# Altium project Skayboard.PrjPcb
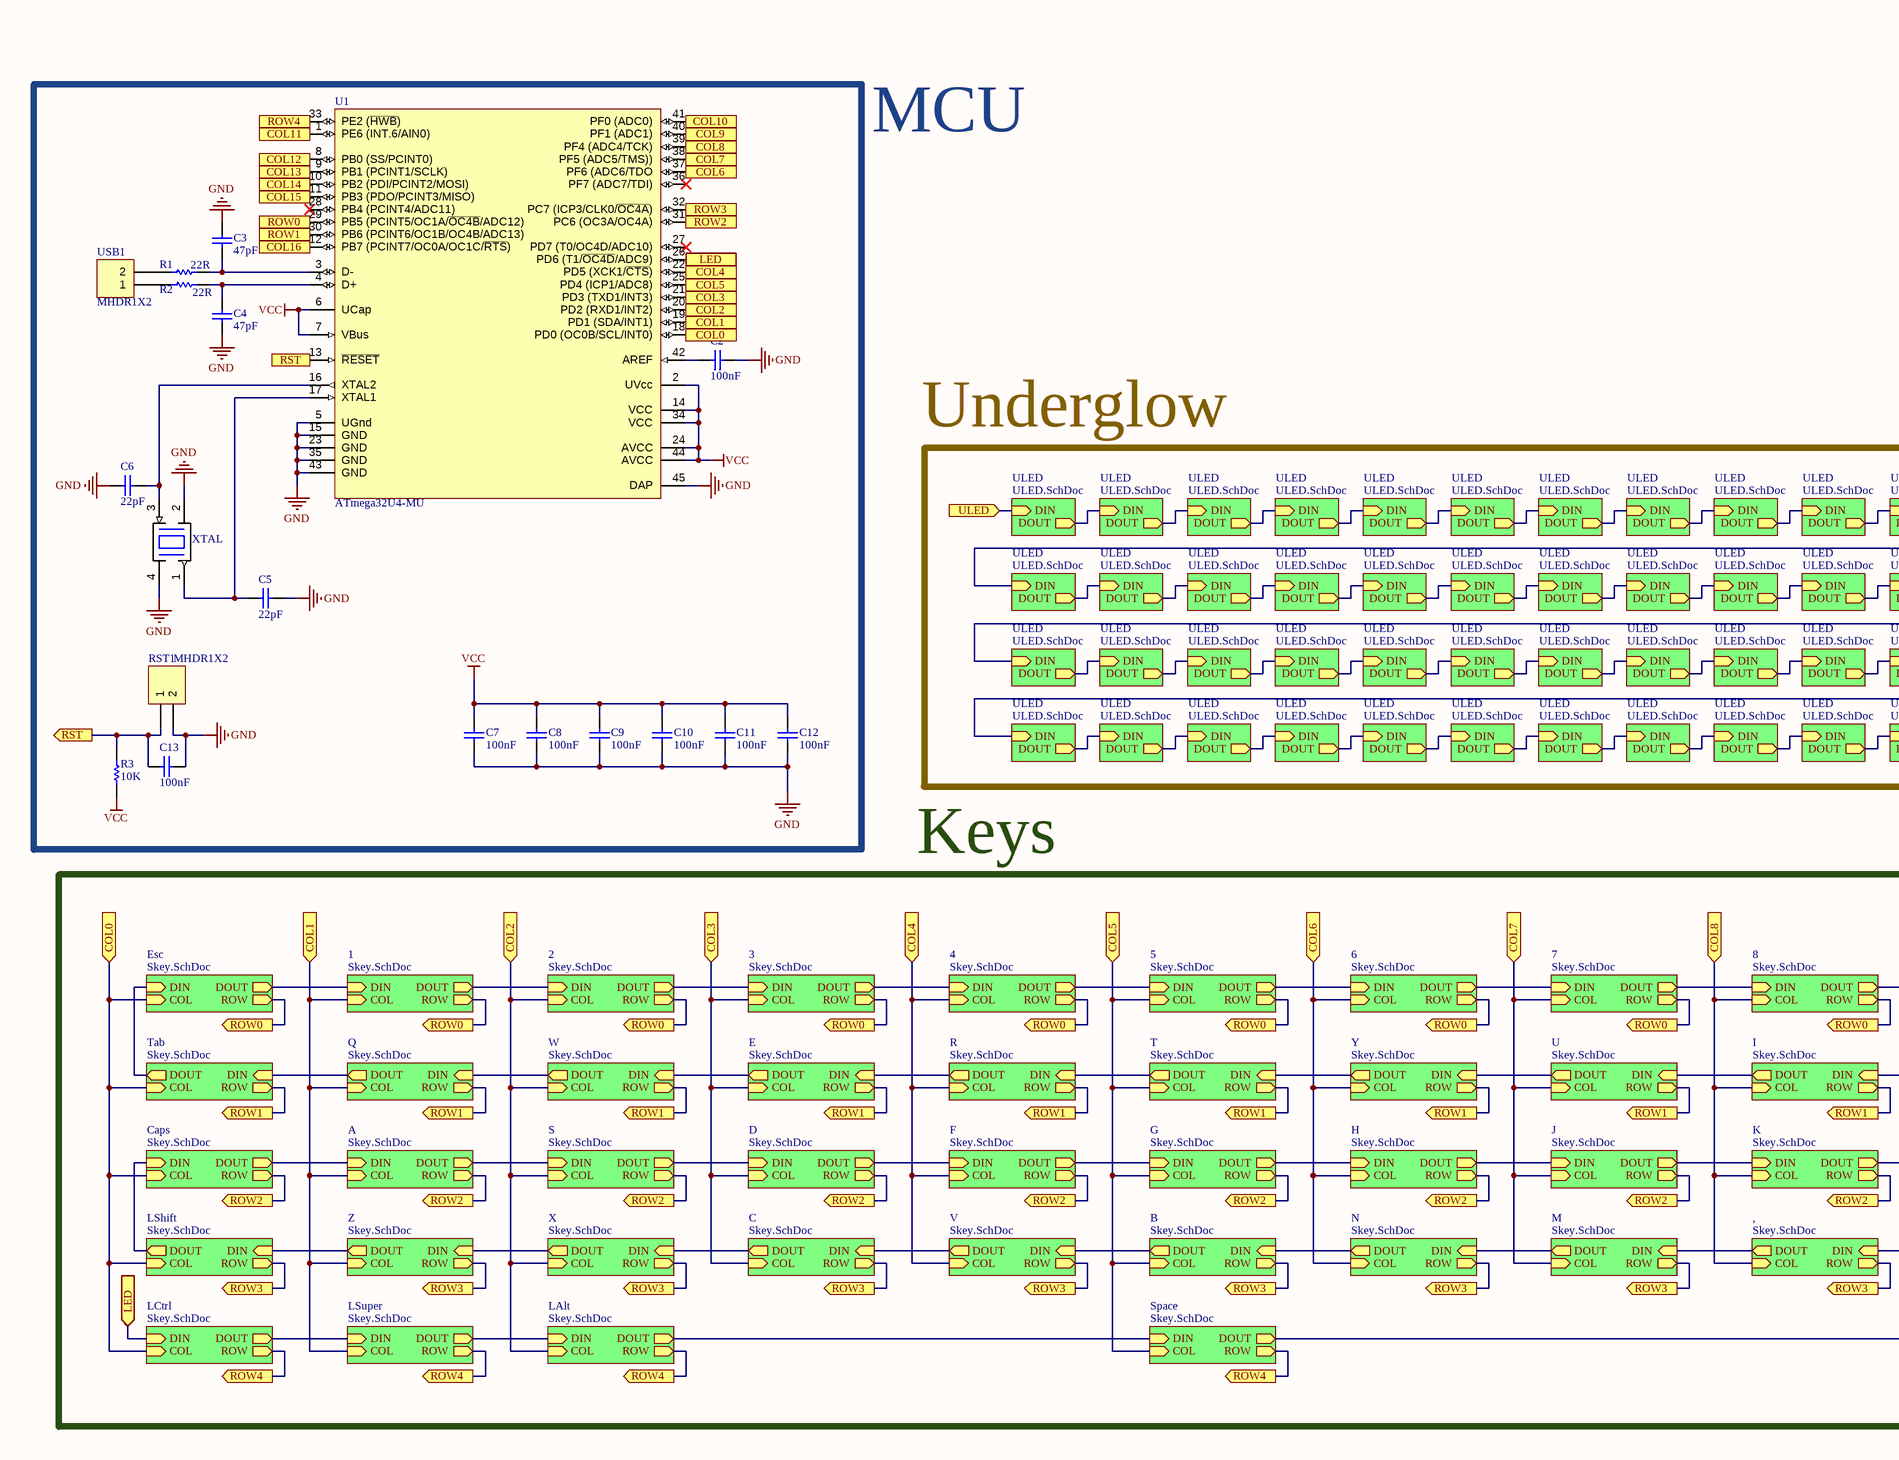
[diagram p0: Skayboard.SchDoc, left]
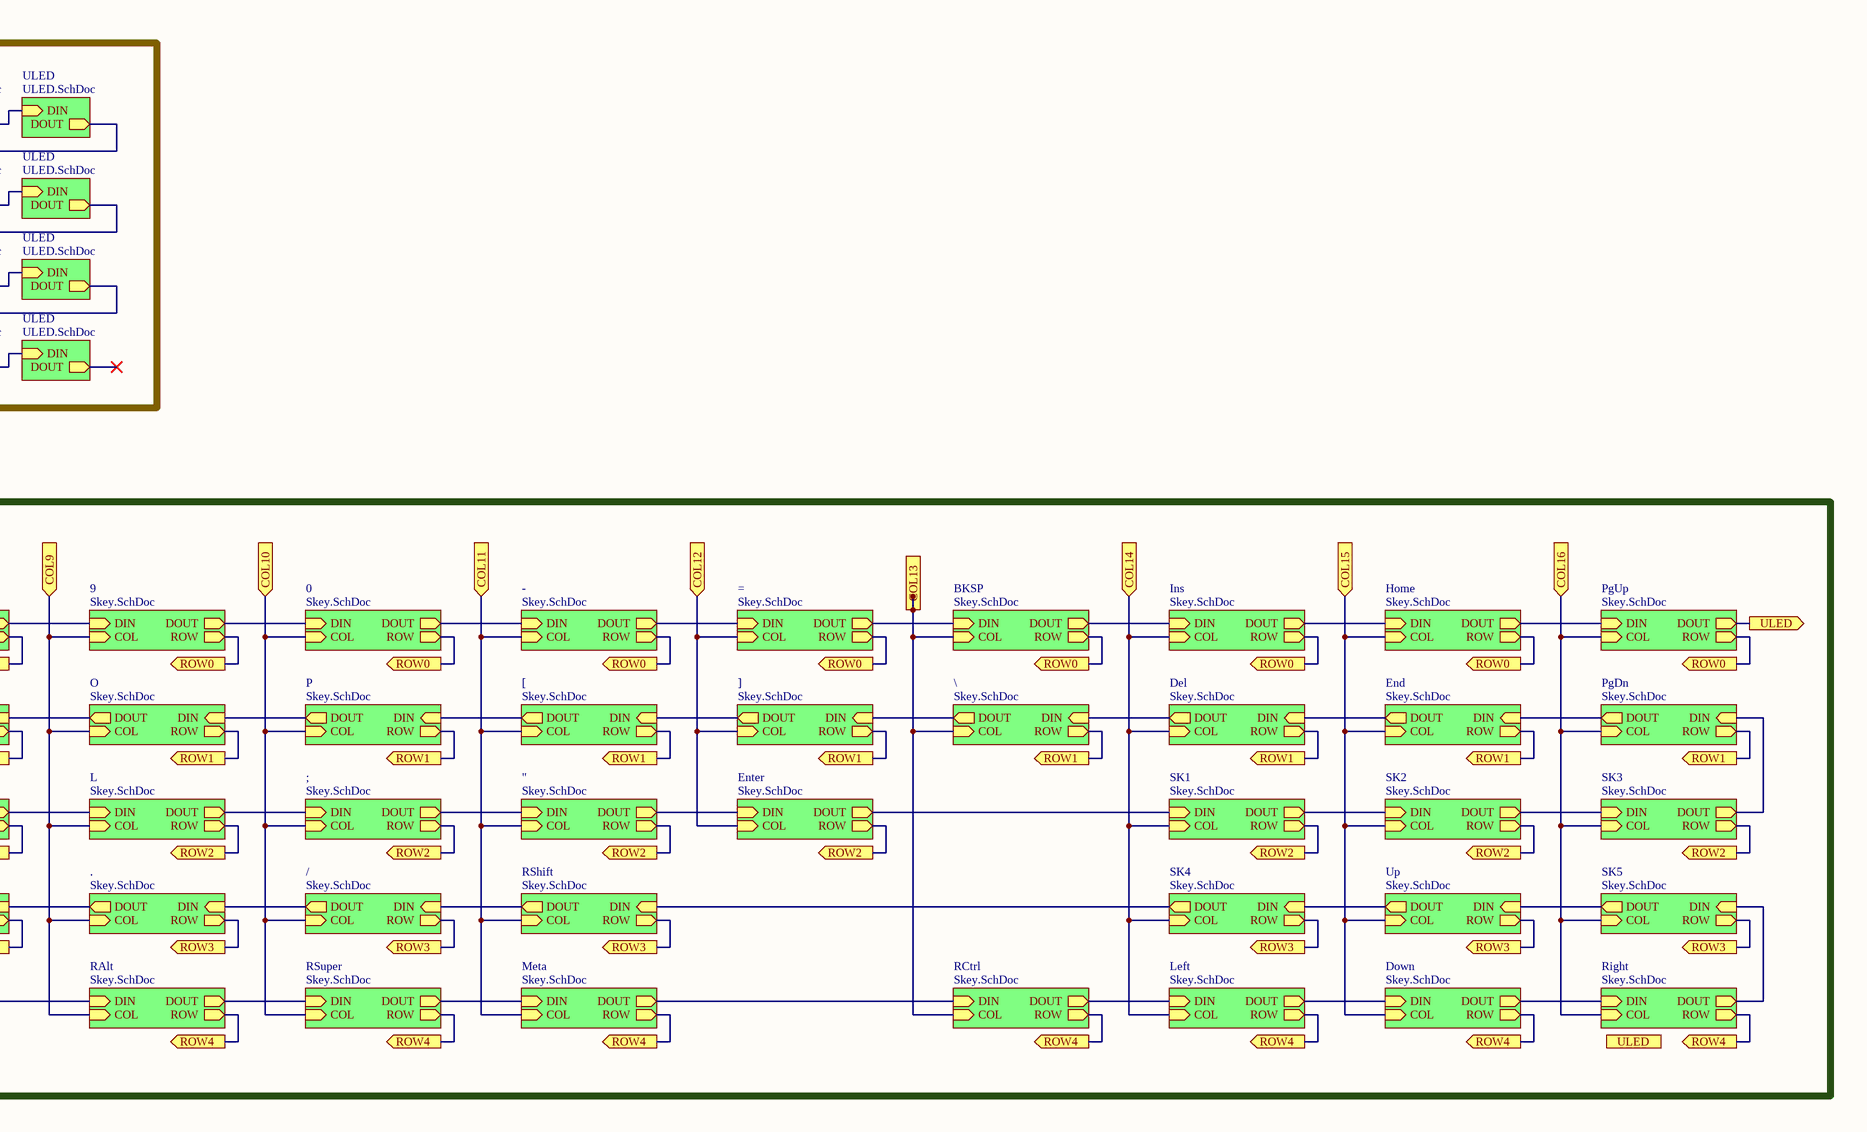
[diagram p1: Skayboard.SchDoc, right]
3 sheets, 411 parts. Net scope: hierarchical (ports join the sheet entries above them; power ports are global).
Board file: Skayboard.PcbDoc
Sheets:
  Skayboard.SchDoc
    ULED = ULED.SchDoc
    ULED = ULED.SchDoc
    ULED = ULED.SchDoc
    ULED = ULED.SchDoc
    ULED = ULED.SchDoc
    ULED = ULED.SchDoc
    ULED = ULED.SchDoc
    ULED = ULED.SchDoc
    ULED = ULED.SchDoc
    ULED = ULED.SchDoc
    ULED = ULED.SchDoc
    ULED = ULED.SchDoc
    ULED = ULED.SchDoc
    ULED = ULED.SchDoc
    ULED = ULED.SchDoc
    ULED = ULED.SchDoc
    ULED = ULED.SchDoc
    ULED = ULED.SchDoc
    ULED = ULED.SchDoc
    ULED = ULED.SchDoc
    ULED = ULED.SchDoc
    ULED = ULED.SchDoc
    ULED = ULED.SchDoc
    ULED = ULED.SchDoc
    ULED = ULED.SchDoc
    ULED = ULED.SchDoc
    ULED = ULED.SchDoc
    ULED = ULED.SchDoc
    ULED = ULED.SchDoc
    ULED = ULED.SchDoc
    ULED = ULED.SchDoc
    ULED = ULED.SchDoc
    ULED = ULED.SchDoc
    ULED = ULED.SchDoc
    ULED = ULED.SchDoc
    ULED = ULED.SchDoc
    ULED = ULED.SchDoc
    ULED = ULED.SchDoc
    ULED = ULED.SchDoc
    ULED = ULED.SchDoc
    ULED = ULED.SchDoc
    ULED = ULED.SchDoc
    ULED = ULED.SchDoc
    ULED = ULED.SchDoc
    Esc = Skey.SchDoc
    1 = Skey.SchDoc
    2 = Skey.SchDoc
    3 = Skey.SchDoc
    4 = Skey.SchDoc
    5 = Skey.SchDoc
    6 = Skey.SchDoc
    7 = Skey.SchDoc
    8 = Skey.SchDoc
    9 = Skey.SchDoc
    0 = Skey.SchDoc
    - = Skey.SchDoc
    = = Skey.SchDoc
    BKSP = Skey.SchDoc
    Ins = Skey.SchDoc
    Home = Skey.SchDoc
    PgUp = Skey.SchDoc
    Q = Skey.SchDoc
    W = Skey.SchDoc
    E = Skey.SchDoc
    R = Skey.SchDoc
    T = Skey.SchDoc
    Y = Skey.SchDoc
    U = Skey.SchDoc
    I = Skey.SchDoc
    O = Skey.SchDoc
    P = Skey.SchDoc
    [ = Skey.SchDoc
    ] = Skey.SchDoc
    \ = Skey.SchDoc
    Del = Skey.SchDoc
    End = Skey.SchDoc
    PgDn = Skey.SchDoc
    A = Skey.SchDoc
    S = Skey.SchDoc
    D = Skey.SchDoc
    F = Skey.SchDoc
    G = Skey.SchDoc
    H = Skey.SchDoc
    J = Skey.SchDoc
    K = Skey.SchDoc
    L = Skey.SchDoc
    ; = Skey.SchDoc
    " = Skey.SchDoc
    Enter = Skey.SchDoc
    RCtrl = Skey.SchDoc
    SK1 = Skey.SchDoc
    SK2 = Skey.SchDoc
    SK3 = Skey.SchDoc
    Z = Skey.SchDoc
    X = Skey.SchDoc
    C = Skey.SchDoc
    V = Skey.SchDoc
    B = Skey.SchDoc
    N = Skey.SchDoc
    M = Skey.SchDoc
    , = Skey.SchDoc
    . = Skey.SchDoc
    / = Skey.SchDoc
    RShift = Skey.SchDoc
    SK4 = Skey.SchDoc
    Up = Skey.SchDoc
    SK5 = Skey.SchDoc
    LSuper = Skey.SchDoc
    LAlt = Skey.SchDoc
    Space = Skey.SchDoc
    RAlt = Skey.SchDoc
    RSuper = Skey.SchDoc
    Meta = Skey.SchDoc
    Left = Skey.SchDoc
    Down = Skey.SchDoc
    Right = Skey.SchDoc
    Tab = Skey.SchDoc
    Caps = Skey.SchDoc
    LShift = Skey.SchDoc
    LCtrl = Skey.SchDoc

## Sheet Skayboard.SchDoc: Skayboard
size 762 x 304 mm; ApprovedBy: NNNI; CheckedBy: NNNI; Author: Skaytacium; CompanyName: Skaytacium Inc.; DrawnBy: Skaytacium; Engineer: SSSI; Organization: Skaytacium Inc.; Revision: 6

### Parts
C2  100nF  [CAPC1005X55X30LL05T10]
C3  47pF  [CAPC1005X55X25LL05T10]
C4  47pF  [CAPC1005X55X25LL05T10]
C5  22pF  [CAPC1005X56X25NL10T15]
C6  22pF  [CAPC1005X56X25NL10T15]
C7  100nF  [CAPC1005X55X30LL05T10]
C8  100nF  [CAPC1005X55X30LL05T10]
C9  100nF  [CAPC1005X55X30LL05T10]
C10  100nF  [CAPC1005X55X30LL05T10]
C11  100nF  [CAPC1005X55X30LL05T10]
C12  100nF  [CAPC1005X55X30LL05T10]
C13  100nF  [CAPC1005X55X30LL05T10]
R1  22R  [RESC1005X40X25LL05T05]
R2  22R  [RESC1005X40X25LL05T05]
R3  10K  [RESC1005X40X25NL05T05]
RST1  MHDR1X2  [MHDR1X2]
U1  ATmega32U4-MU  [44PW_M]
USB1  MHDR1X2  [MHDR1X2]
XTAL  16MCR  [XTAL16M]  (value not drawn)

### Sub-sheets
0 = Skey.SchDoc: ROW (out), COL (in), DIN (in), DOUT (out)
1 = Skey.SchDoc: ROW (out), COL (in), DIN (in), DOUT (out)
2 = Skey.SchDoc: ROW (out), COL (in), DIN (in), DOUT (out)
3 = Skey.SchDoc: ROW (out), COL (in), DIN (in), DOUT (out)
4 = Skey.SchDoc: ROW (out), COL (in), DIN (in), DOUT (out)
5 = Skey.SchDoc: ROW (out), COL (in), DIN (in), DOUT (out)
6 = Skey.SchDoc: ROW (out), COL (in), DIN (in), DOUT (out)
7 = Skey.SchDoc: ROW (out), COL (in), DIN (in), DOUT (out)
8 = Skey.SchDoc: ROW (out), COL (in), DIN (in), DOUT (out)
9 = Skey.SchDoc: ROW (out), COL (in), DIN (in), DOUT (out)
" = Skey.SchDoc: ROW (out), COL (in), DIN (in), DOUT (out)
, = Skey.SchDoc: ROW (out), COL (in), DIN (in), DOUT (out)
- = Skey.SchDoc: ROW (out), COL (in), DIN (in), DOUT (out)
. = Skey.SchDoc: ROW (out), COL (in), DIN (in), DOUT (out)
/ = Skey.SchDoc: ROW (out), COL (in), DIN (in), DOUT (out)
; = Skey.SchDoc: ROW (out), COL (in), DIN (in), DOUT (out)
= = Skey.SchDoc: ROW (out), COL (in), DIN (in), DOUT (out)
[ = Skey.SchDoc: ROW (out), COL (in), DIN (in), DOUT (out)
\ = Skey.SchDoc: ROW (out), COL (in), DIN (in), DOUT (out)
] = Skey.SchDoc: ROW (out), COL (in), DIN (in), DOUT (out)
A = Skey.SchDoc: ROW (out), COL (in), DIN (in), DOUT (out)
B = Skey.SchDoc: ROW (out), COL (in), DIN (in), DOUT (out)
BKSP = Skey.SchDoc: ROW (out), COL (in), DIN (in), DOUT (out)
C = Skey.SchDoc: ROW (out), COL (in), DIN (in), DOUT (out)
Caps = Skey.SchDoc: ROW (out), COL (in), DIN (in), DOUT (out)
D = Skey.SchDoc: ROW (out), COL (in), DIN (in), DOUT (out)
Del = Skey.SchDoc: ROW (out), COL (in), DIN (in), DOUT (out)
Down = Skey.SchDoc: ROW (out), COL (in), DIN (in), DOUT (out)
E = Skey.SchDoc: ROW (out), COL (in), DIN (in), DOUT (out)
End = Skey.SchDoc: ROW (out), COL (in), DIN (in), DOUT (out)
Enter = Skey.SchDoc: ROW (out), COL (in), DIN (in), DOUT (out)
Esc = Skey.SchDoc: ROW (out), COL (in), DIN (in), DOUT (out)
F = Skey.SchDoc: ROW (out), COL (in), DIN (in), DOUT (out)
G = Skey.SchDoc: ROW (out), COL (in), DIN (in), DOUT (out)
H = Skey.SchDoc: ROW (out), COL (in), DIN (in), DOUT (out)
Home = Skey.SchDoc: ROW (out), COL (in), DIN (in), DOUT (out)
I = Skey.SchDoc: ROW (out), COL (in), DIN (in), DOUT (out)
Ins = Skey.SchDoc: ROW (out), COL (in), DIN (in), DOUT (out)
J = Skey.SchDoc: ROW (out), COL (in), DIN (in), DOUT (out)
K = Skey.SchDoc: ROW (out), COL (in), DIN (in), DOUT (out)
L = Skey.SchDoc: ROW (out), COL (in), DIN (in), DOUT (out)
LAlt = Skey.SchDoc: ROW (out), COL (in), DIN (in), DOUT (out)
LCtrl = Skey.SchDoc: ROW (out), COL (in), DIN (in), DOUT (out)
Left = Skey.SchDoc: ROW (out), COL (in), DIN (in), DOUT (out)
LShift = Skey.SchDoc: ROW (out), COL (in), DIN (in), DOUT (out)
LSuper = Skey.SchDoc: ROW (out), COL (in), DIN (in), DOUT (out)
M = Skey.SchDoc: ROW (out), COL (in), DIN (in), DOUT (out)
Meta = Skey.SchDoc: ROW (out), COL (in), DIN (in), DOUT (out)
N = Skey.SchDoc: ROW (out), COL (in), DIN (in), DOUT (out)
O = Skey.SchDoc: ROW (out), COL (in), DIN (in), DOUT (out)
P = Skey.SchDoc: ROW (out), COL (in), DIN (in), DOUT (out)
PgDn = Skey.SchDoc: ROW (out), COL (in), DIN (in), DOUT (out)
PgUp = Skey.SchDoc: ROW (out), COL (in), DIN (in), DOUT (out)
Q = Skey.SchDoc: ROW (out), COL (in), DIN (in), DOUT (out)
R = Skey.SchDoc: ROW (out), COL (in), DIN (in), DOUT (out)
RAlt = Skey.SchDoc: ROW (out), COL (in), DIN (in), DOUT (out)
RCtrl = Skey.SchDoc: ROW (out), COL (in), DIN (in), DOUT (out)
Right = Skey.SchDoc: ROW (out), COL (in), DIN (in), DOUT (out)
RShift = Skey.SchDoc: ROW (out), COL (in), DIN (in), DOUT (out)
RSuper = Skey.SchDoc: ROW (out), COL (in), DIN (in), DOUT (out)
S = Skey.SchDoc: ROW (out), COL (in), DIN (in), DOUT (out)
SK1 = Skey.SchDoc: ROW (out), COL (in), DIN (in), DOUT (out)
SK2 = Skey.SchDoc: ROW (out), COL (in), DIN (in), DOUT (out)
SK3 = Skey.SchDoc: ROW (out), COL (in), DIN (in), DOUT (out)
SK4 = Skey.SchDoc: ROW (out), COL (in), DIN (in), DOUT (out)
SK5 = Skey.SchDoc: ROW (out), COL (in), DIN (in), DOUT (out)
Space = Skey.SchDoc: ROW (out), COL (in), DIN (in), DOUT (out)
T = Skey.SchDoc: ROW (out), COL (in), DIN (in), DOUT (out)
Tab = Skey.SchDoc: ROW (out), COL (in), DIN (in), DOUT (out)
U = Skey.SchDoc: ROW (out), COL (in), DIN (in), DOUT (out)
ULED = ULED.SchDoc: DOUT (out), DIN (in)
ULED = ULED.SchDoc: DOUT (out), DIN (in)
ULED = ULED.SchDoc: DOUT (out), DIN (in)
ULED = ULED.SchDoc: DOUT (out), DIN (in)
ULED = ULED.SchDoc: DOUT (out), DIN (in)
ULED = ULED.SchDoc: DOUT (out), DIN (in)
ULED = ULED.SchDoc: DOUT (out), DIN (in)
ULED = ULED.SchDoc: DOUT (out), DIN (in)
ULED = ULED.SchDoc: DOUT (out), DIN (in)
ULED = ULED.SchDoc: DOUT (out), DIN (in)
ULED = ULED.SchDoc: DOUT (out), DIN (in)
ULED = ULED.SchDoc: DOUT (out), DIN (in)
ULED = ULED.SchDoc: DOUT (out), DIN (in)
ULED = ULED.SchDoc: DOUT (out), DIN (in)
ULED = ULED.SchDoc: DOUT (out), DIN (in)
ULED = ULED.SchDoc: DOUT (out), DIN (in)
ULED = ULED.SchDoc: DOUT (out), DIN (in)
ULED = ULED.SchDoc: DOUT (out), DIN (in)
ULED = ULED.SchDoc: DOUT (out), DIN (in)
ULED = ULED.SchDoc: DOUT (out), DIN (in)
ULED = ULED.SchDoc: DOUT (out), DIN (in)
ULED = ULED.SchDoc: DOUT (out), DIN (in)
ULED = ULED.SchDoc: DOUT (out), DIN (in)
ULED = ULED.SchDoc: DOUT (out), DIN (in)
ULED = ULED.SchDoc: DOUT (out), DIN (in)
ULED = ULED.SchDoc: DOUT (out), DIN (in)
ULED = ULED.SchDoc: DOUT (out), DIN (in)
ULED = ULED.SchDoc: DOUT (out), DIN (in)
ULED = ULED.SchDoc: DOUT (out), DIN (in)
ULED = ULED.SchDoc: DOUT (out), DIN (in)
ULED = ULED.SchDoc: DOUT (out), DIN (in)
ULED = ULED.SchDoc: DOUT (out), DIN (in)
ULED = ULED.SchDoc: DOUT (out), DIN (in)
ULED = ULED.SchDoc: DOUT (out), DIN (in)
ULED = ULED.SchDoc: DOUT (out), DIN (in)
ULED = ULED.SchDoc: DOUT (out), DIN (in)
ULED = ULED.SchDoc: DOUT (out), DIN (in)
ULED = ULED.SchDoc: DOUT (out), DIN (in)
ULED = ULED.SchDoc: DOUT (out), DIN (in)
ULED = ULED.SchDoc: DOUT (out), DIN (in)
ULED = ULED.SchDoc: DOUT (out), DIN (in)
ULED = ULED.SchDoc: DOUT (out), DIN (in)
ULED = ULED.SchDoc: DOUT (out), DIN (in)
ULED = ULED.SchDoc: DOUT (out), DIN (in)
Up = Skey.SchDoc: ROW (out), COL (in), DIN (in), DOUT (out)
V = Skey.SchDoc: ROW (out), COL (in), DIN (in), DOUT (out)
W = Skey.SchDoc: ROW (out), COL (in), DIN (in), DOUT (out)
X = Skey.SchDoc: ROW (out), COL (in), DIN (in), DOUT (out)
Y = Skey.SchDoc: ROW (out), COL (in), DIN (in), DOUT (out)
Z = Skey.SchDoc: ROW (out), COL (in), DIN (in), DOUT (out)

### Ports
COL0 (in), COL0 (out), COL1 (in), COL1 (out), COL2 (in), COL2 (out), COL3 (in), COL3 (out), COL4 (in), COL4 (out), COL5 (in), COL5 (out), COL6 (in), COL6 (out), COL7 (in), COL7 (out), COL8 (in), COL8 (out), COL9 (in), COL9 (out), COL10 (in), COL10 (out), COL11 (in), COL11 (out), COL12 (in), COL12 (out), COL13 (in), COL13 (out), COL14 (in), COL14 (out), COL15 (in), COL15 (out), COL16 (in), COL16 (out), LED (in), LED (out), ROW0 (in), ROW0 (out), ROW1 (in), ROW1 (out), ROW2 (in), ROW2 (out), ROW3 (in), ROW3 (out), ROW4 (in), ROW4 (out), RST (in), RST (out), ULED (in), ULED (out)

### Nets
GND: C2.2 C3.2 C4.1 C5.1 C6.1 C7.1 C8.1 C9.1 C10.1 C11.1 C12.1 C13.1 RST1.2 U1.5(UGnd) U1.15(GND) U1.23(GND) U1.35(GND) U1.43(GND) U1.45(DAP) XTAL.2 XTAL.4
VCC: C7.2 C8.2 C9.2 C10.2 C11.2 C12.2 R3.1 U1.2(UVcc) U1.6(UCap) U1.7(VBus) U1.14(VCC) U1.24(AVCC) U1.34(VCC) U1.44(AVCC)
NetC2_1: C2.1 U1.42(AREF)
NetC3_1: C3.1 R1.1 U1.3(D-)
NetC4_2: C4.2 R2.1 U1.4(D+)
NetC5_2: C5.2 U1.17(XTAL1) XTAL.1
NetC6_2: C6.2 U1.16(XTAL2) XTAL.3
NetC13_2: C13.2 R3.2 RST1.1 U1.13(~{RESET}) ; port RST
NetD_0_2: U1.29(PB5_(PCINT5/OC1A/~{OC4B}/ADC12)) ; port ROW0, sheet Esc/ROW, sheet 1/ROW, sheet 2/ROW, sheet 3/ROW, sheet 4/ROW, sheet 5/ROW, sheet 6/ROW, sheet 7/ROW, sheet 8/ROW, sheet 9/ROW, sheet 0/ROW, sheet -/ROW, sheet =/ROW, sheet BKSP/ROW, sheet Ins/ROW, sheet Home/ROW, sheet PgUp/ROW
NetD_"_2: U1.31(PC6_(OC3A/OC4A)) ; port ROW2, sheet A/ROW, sheet S/ROW, sheet D/ROW, sheet F/ROW, sheet G/ROW, sheet H/ROW, sheet J/ROW, sheet K/ROW, sheet L/ROW, sheet ;/ROW, sheet "/ROW, sheet Enter/ROW, sheet SK1/ROW, sheet SK2/ROW, sheet SK3/ROW, sheet Caps/ROW
NetD_,_2: U1.32(PC7_(ICP3/CLK0/~{OC4A})) ; port ROW3, sheet Z/ROW, sheet X/ROW, sheet C/ROW, sheet V/ROW, sheet B/ROW, sheet N/ROW, sheet M/ROW, sheet ,/ROW, sheet ./ROW, sheet //ROW, sheet RShift/ROW, sheet SK4/ROW, sheet Up/ROW, sheet SK5/ROW, sheet LShift/ROW
NetD_[_2: U1.30(PB6_(PCINT6/OC1B/OC4B/ADC13)) ; port ROW1, sheet Q/ROW, sheet W/ROW, sheet E/ROW, sheet R/ROW, sheet T/ROW, sheet Y/ROW, sheet U/ROW, sheet I/ROW, sheet O/ROW, sheet P/ROW, sheet [/ROW, sheet ]/ROW, sheet \/ROW, sheet Del/ROW, sheet End/ROW, sheet PgDn/ROW, sheet Tab/ROW
NetD_Down_2: U1.33(PE2_(~{HWB})) ; port ROW4, sheet RCtrl/ROW, sheet LSuper/ROW, sheet LAlt/ROW, sheet Space/ROW, sheet RAlt/ROW, sheet RSuper/ROW, sheet Meta/ROW, sheet Left/ROW, sheet Down/ROW, sheet Right/ROW, sheet LCtrl/ROW
NetLED_0_2: sheet 0/DOUT, sheet -/DIN
NetLED_0_4: sheet 9/DOUT, sheet 0/DIN
NetLED_1_2: sheet 1/DOUT, sheet 2/DIN
NetLED_1_4: sheet Esc/DOUT, sheet 1/DIN
NetLED_2_2: sheet 2/DOUT, sheet 3/DIN
NetLED_3_2: sheet 3/DOUT, sheet 4/DIN
NetLED_4_2: sheet 4/DOUT, sheet 5/DIN
NetLED_5_2: sheet 5/DOUT, sheet 6/DIN
NetLED_6_2: sheet 6/DOUT, sheet 7/DIN
NetLED_7_2: sheet 7/DOUT, sheet 8/DIN
NetLED_8_2: sheet 8/DOUT, sheet 9/DIN
NetLED_"_2: sheet "/DOUT, sheet Enter/DIN
NetLED_"_4: sheet ;/DOUT, sheet "/DIN
NetLED_,_2: sheet M/DIN, sheet ,/DOUT
NetLED_,_4: sheet ,/DIN, sheet ./DOUT
NetLED_-_2: sheet -/DOUT, sheet =/DIN
NetLED_._4: sheet ./DIN, sheet //DOUT
NetLED_/_4: sheet //DIN, sheet RShift/DOUT
NetLED_;_4: sheet L/DOUT, sheet ;/DIN
NetLED_=_2: sheet =/DOUT, sheet BKSP/DIN
NetLED_[_2: sheet P/DIN, sheet [/DOUT
NetLED_[_4: sheet [/DIN, sheet ]/DOUT
NetLED~{_}_2: sheet ]/DIN, sheet \/DOUT
NetLED~{_}_4: sheet \/DIN, sheet Del/DOUT
NetLED_A_2: sheet A/DOUT, sheet S/DIN
NetLED_A_4: sheet A/DIN, sheet Caps/DOUT
NetLED_B_2: sheet V/DIN, sheet B/DOUT
NetLED_B_4: sheet B/DIN, sheet N/DOUT
NetLED_BKSP_2: sheet BKSP/DOUT, sheet Ins/DIN
NetLED_C_2: sheet X/DIN, sheet C/DOUT
NetLED_C_4: sheet C/DIN, sheet V/DOUT
NetLED_Caps_4: sheet Caps/DIN, sheet LShift/DOUT
NetLED_D_2: sheet D/DOUT, sheet F/DIN
NetLED_D_4: sheet S/DOUT, sheet D/DIN
NetLED_Del_4: sheet Del/DIN, sheet End/DOUT
NetLED_Down_2: sheet Down/DOUT, sheet Right/DIN
NetLED_Down_4: sheet Left/DOUT, sheet Down/DIN
NetLED_E_2: sheet W/DIN, sheet E/DOUT
NetLED_E_4: sheet E/DIN, sheet R/DOUT
NetLED_End_4: sheet End/DIN, sheet PgDn/DOUT
NetLED_Enter_2: sheet Enter/DOUT, sheet SK1/DIN
NetLED_Esc_4: sheet Esc/DIN, sheet Tab/DOUT
NetLED_F_2: sheet F/DOUT, sheet G/DIN
NetLED_G_2: sheet G/DOUT, sheet H/DIN
NetLED_H_2: sheet H/DOUT, sheet J/DIN
NetLED_Home_2: sheet Home/DOUT, sheet PgUp/DIN
NetLED_Home_4: sheet Ins/DOUT, sheet Home/DIN
NetLED_I_2: sheet U/DIN, sheet I/DOUT
NetLED_I_4: sheet I/DIN, sheet O/DOUT
NetLED_J_2: sheet J/DOUT, sheet K/DIN
NetLED_K_2: sheet K/DOUT, sheet L/DIN
NetLED_LAlt_2: sheet LAlt/DOUT, sheet Space/DIN
NetLED_LAlt_4: sheet LSuper/DOUT, sheet LAlt/DIN
NetLED_LCtrl_2: sheet LSuper/DIN, sheet LCtrl/DOUT
NetLED_LCtrl_4: U1.26(PD6_(T1/~{OC4D}/ADC9)) ; port LED, sheet LCtrl/DIN
NetLED_Left_4: sheet RCtrl/DOUT, sheet Left/DIN
NetLED_LShift_4: sheet Z/DOUT, sheet LShift/DIN
NetLED_M_2: sheet N/DIN, sheet M/DOUT
NetLED_Meta_2: sheet RCtrl/DIN, sheet Meta/DOUT
NetLED_Meta_4: sheet RSuper/DOUT, sheet Meta/DIN
NetLED_O_4: sheet O/DIN, sheet P/DOUT
NetLED_PgDn_4: sheet PgDn/DIN, sheet SK3/DOUT
NetLED_PgUp_2: port ULED, sheet ULED/DIN, sheet PgUp/DOUT
NetLED_Q_2: sheet Q/DOUT, sheet Tab/DIN
NetLED_Q_4: sheet Q/DIN, sheet W/DOUT
NetLED_R_4: sheet R/DIN, sheet T/DOUT
NetLED_RAlt_2: sheet RAlt/DOUT, sheet RSuper/DIN
NetLED_RAlt_4: sheet Space/DOUT, sheet RAlt/DIN
NetLED_Right_2: sheet SK5/DIN, sheet Right/DOUT
NetLED_RShift_4: sheet RShift/DIN, sheet SK4/DOUT
NetLED_SK1_2: sheet SK1/DOUT, sheet SK2/DIN
NetLED_SK2_2: sheet SK2/DOUT, sheet SK3/DIN
NetLED_SK4_4: sheet SK4/DIN, sheet Up/DOUT
NetLED_SK5_2: sheet Up/DIN, sheet SK5/DOUT
NetLED_T_4: sheet T/DIN, sheet Y/DOUT
NetLED_U_2: sheet Y/DIN, sheet U/DOUT
NetLED_X_2: sheet Z/DIN, sheet X/DOUT
NetMX_0_1: U1.41(PF0_(ADC0)) ; port COL10, sheet 0/COL, sheet P/COL, sheet ;/COL, sheet //COL, sheet RSuper/COL
NetMX_1_1: U1.19(PD1_(SDA/INT1)) ; port COL1, sheet 1/COL, sheet Q/COL, sheet A/COL, sheet Z/COL, sheet LSuper/COL
NetMX_2_1: U1.20(PD2_(RXD1/INT2)) ; port COL2, sheet 2/COL, sheet W/COL, sheet S/COL, sheet X/COL, sheet LAlt/COL
NetMX_3_1: U1.21(PD3_(TXD1/INT3)) ; port COL3, sheet 3/COL, sheet E/COL, sheet D/COL, sheet C/COL
NetMX_4_1: U1.22(PD5_(XCK1/~{CTS})) ; port COL4, sheet 4/COL, sheet R/COL, sheet F/COL, sheet V/COL
NetMX_5_1: U1.25(PD4_(ICP1/ADC8)) ; port COL5, sheet 5/COL, sheet T/COL, sheet G/COL, sheet B/COL, sheet Space/COL
NetMX_6_1: U1.37(PF6_(ADC6/TDO) ; port COL6, sheet 6/COL, sheet Y/COL, sheet H/COL, sheet N/COL
NetMX_7_1: U1.38(PF5_(ADC5/TMS))) ; port COL7, sheet 7/COL, sheet U/COL, sheet J/COL, sheet M/COL
NetMX_8_1: U1.39(PF4_(ADC4/TCK)) ; port COL8, sheet 8/COL, sheet I/COL, sheet K/COL, sheet ,/COL
NetMX_9_1: U1.40(PF1_(ADC1)) ; port COL9, sheet 9/COL, sheet O/COL, sheet L/COL, sheet ./COL, sheet RAlt/COL
NetMX_"_1: U1.1(PE6_(INT.6/AIN0)) ; port COL11, sheet -/COL, sheet [/COL, sheet "/COL, sheet RShift/COL, sheet Meta/COL
NetMX_=_1: U1.8(PB0_(SS/PCINT0)) ; port COL12, sheet =/COL, sheet ]/COL, sheet Enter/COL
NetMX~{_}_1: U1.9(PB1_(PCINT1/SCLK)) ; port COL13, sheet BKSP/COL, sheet \/COL, sheet RCtrl/COL
NetMX_Caps_1: U1.18(PD0_(OC0B/SCL/INT0)) ; port COL0, sheet Esc/COL, sheet Tab/COL, sheet Caps/COL, sheet LShift/COL, sheet LCtrl/COL
NetMX_Del_1: U1.10(PB2_(PDI/PCINT2/MOSI)) ; port COL14, sheet Ins/COL, sheet Del/COL, sheet SK1/COL, sheet SK4/COL, sheet Left/COL
NetMX_Down_1: U1.11(PB3_(PDO/PCINT3/MISO)) ; port COL15, sheet Home/COL, sheet End/COL, sheet SK2/COL, sheet Up/COL, sheet Down/COL
NetMX_PgDn_1: U1.12(PB7_(PCINT7/OC0A/OC1C/~{RTS})) ; port COL16, sheet PgUp/COL, sheet PgDn/COL, sheet SK3/COL, sheet SK5/COL, sheet Right/COL
NetR1_2: R1.2 USB1.2
NetR2_2: R2.2 USB1.1
NetSKLED#1_2: sheet ULED/DOUT, sheet ULED/DIN
NetSKLED#2_2: sheet ULED/DOUT, sheet ULED/DIN
NetSKLED#3_2: sheet ULED/DOUT, sheet ULED/DIN
NetSKLED#4_2: sheet ULED/DOUT, sheet ULED/DIN
NetSKLED#5_2: sheet ULED/DOUT, sheet ULED/DIN
NetSKLED#6_2: sheet ULED/DOUT, sheet ULED/DIN
NetSKLED#7_2: sheet ULED/DOUT, sheet ULED/DIN
NetSKLED#8_2: sheet ULED/DOUT, sheet ULED/DIN
NetSKLED#9_2: sheet ULED/DOUT, sheet ULED/DIN
NetSKLED#10_2: sheet ULED/DOUT, sheet ULED/DIN
NetSKLED#11_2: sheet ULED/DOUT, sheet ULED/DIN
NetSKLED#12_2: sheet ULED/DOUT, sheet ULED/DIN
NetSKLED#13_2: sheet ULED/DOUT, sheet ULED/DIN
NetSKLED#14_2: sheet ULED/DOUT, sheet ULED/DIN
NetSKLED#15_2: sheet ULED/DOUT, sheet ULED/DIN
NetSKLED#16_2: sheet ULED/DOUT, sheet ULED/DIN
NetSKLED#17_2: sheet ULED/DOUT, sheet ULED/DIN
NetSKLED#18_2: sheet ULED/DOUT, sheet ULED/DIN
NetSKLED#19_2: sheet ULED/DOUT, sheet ULED/DIN
NetSKLED#20_2: sheet ULED/DOUT, sheet ULED/DIN
NetSKLED#21_2: sheet ULED/DOUT, sheet ULED/DIN
NetSKLED#22_2: sheet ULED/DOUT, sheet ULED/DIN
NetSKLED#23_2: sheet ULED/DOUT, sheet ULED/DIN
NetSKLED#24_2: sheet ULED/DOUT, sheet ULED/DIN
NetSKLED#25_2: sheet ULED/DOUT, sheet ULED/DIN
NetSKLED#26_2: sheet ULED/DOUT, sheet ULED/DIN
NetSKLED#27_2: sheet ULED/DOUT, sheet ULED/DIN
NetSKLED#28_2: sheet ULED/DOUT, sheet ULED/DIN
NetSKLED#29_2: sheet ULED/DOUT, sheet ULED/DIN
NetSKLED#30_2: sheet ULED/DOUT, sheet ULED/DIN
NetSKLED#31_2: sheet ULED/DOUT, sheet ULED/DIN
NetSKLED#32_2: sheet ULED/DOUT, sheet ULED/DIN
NetSKLED#33_2: sheet ULED/DOUT, sheet ULED/DIN
NetSKLED#34_2: sheet ULED/DOUT, sheet ULED/DIN
NetSKLED#35_2: sheet ULED/DOUT, sheet ULED/DIN
NetSKLED#36_2: sheet ULED/DOUT, sheet ULED/DIN
NetSKLED#37_2: sheet ULED/DOUT, sheet ULED/DIN
NetSKLED#38_2: sheet ULED/DOUT, sheet ULED/DIN
NetSKLED#39_2: sheet ULED/DOUT, sheet ULED/DIN
NetSKLED#40_2: sheet ULED/DOUT, sheet ULED/DIN
NetSKLED#41_2: sheet ULED/DOUT, sheet ULED/DIN
NetSKLED#42_2: sheet ULED/DOUT, sheet ULED/DIN
NetSKLED#43_2: sheet ULED/DOUT, sheet ULED/DIN

Not connected (* = marked no-connect by the designer): U1 27(PD7_(T0/OC4D/ADC10))* 28(PB4_(PCINT4/ADC11))* 36(PF7_(ADC7/TDI))*

### Notes on the sheet
- MCU
- Underglow
- Keys

### Library data of the parts
C2 C7-C13 = CMP-0001-00074-2: Manufacturer: Kemet; Part Number: C0402C104K4RACTU
C3 C4 = CMP-2008-04368-1: Part Number: GRM1555C1H470JA01D; Manufacturer: Murata
C5 C6 = CMP-2008-02613-1: Part Number: 04025A220JAT2A; Manufacturer: AVX Interconnect / Elco
R1 R2 = CMP-2002-08382-1: 22; Manufacturer: Vishay Dale; Part Number: CRCW040222R0FKED
R3 = CMP-2002-01183-1: Part Number: ERT-J0ER103J; Manufacturer: Panasonic
RST1 USB1 = MHDR1X2: Header, 2-Pin
U1 = CMP-0095-00166-2: 8-bit AVR Microcontroller, 2.7-5.5V, 16MHz, 32KB Flash, 1KB EEPROM, 2.5KB SRAM, USB Controller, 44-pin QFN, Industrial Grade (-40°C to 85°C), Ext Osc
XTAL = 16MCR: 16Mhz crystal resonator, JLCPCB #C13738

## Sheet ULED.SchDoc
size 76 x 50 mm
Used 44 times, as channels ULED, ULED, ULED, ULED, ULED, ULED, ULED, ULED, ULED, ULED, ULED, ULED, ULED, ULED, ULED, ULED, ULED, ULED, ULED, ULED, ULED, ULED, ULED, ULED, ULED, ULED, ULED, ULED, ULED, ULED, ULED, ULED, ULED, ULED, ULED, ULED, ULED, ULED, ULED, ULED, ULED, ULED, ULED, ULED. Parts and nets are listed once, with the designators drawn on the sheet.
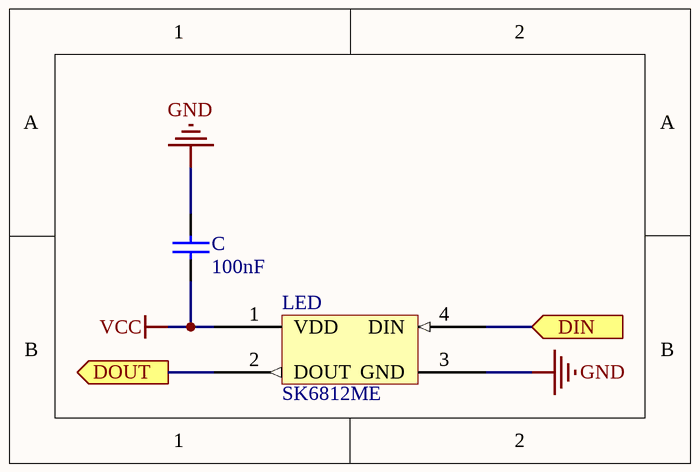
[diagram p2: ULED.SchDoc]

### Parts
C  100nF  [CAPC1005X55X30LL05T10]
LED  SK6812ME  [SK6812ME]

### Ports
DIN (in), DOUT (out)

### Nets
GND: C.2 LED.3(GND)
VCC: C.1 LED.1(VDD)
DIN: LED.4(DIN) ; port DIN
DOUT: LED.2(DOUT) ; port DOUT

### Channels
ULED: designators C=C1#1 LED=SKLED#1; ports DIN=NetLED_PgUp_2 DOUT=NetSKLED#1_2
ULED: designators C=C1#2 LED=SKLED#2; ports DIN=NetSKLED#1_2 DOUT=NetSKLED#2_2
ULED: designators C=C1#3 LED=SKLED#3; ports DIN=NetSKLED#2_2 DOUT=NetSKLED#3_2
ULED: designators C=C1#4 LED=SKLED#4; ports DIN=NetSKLED#3_2 DOUT=NetSKLED#4_2
ULED: designators C=C1#5 LED=SKLED#5; ports DIN=NetSKLED#4_2 DOUT=NetSKLED#5_2
ULED: designators C=C1#6 LED=SKLED#6; ports DIN=NetSKLED#5_2 DOUT=NetSKLED#6_2
ULED: designators C=C1#7 LED=SKLED#7; ports DIN=NetSKLED#6_2 DOUT=NetSKLED#7_2
ULED: designators C=C1#8 LED=SKLED#8; ports DIN=NetSKLED#7_2 DOUT=NetSKLED#8_2
ULED: designators C=C1#9 LED=SKLED#9; ports DIN=NetSKLED#8_2 DOUT=NetSKLED#9_2
ULED: designators C=C1#10 LED=SKLED#10; ports DIN=NetSKLED#9_2 DOUT=NetSKLED#10_2
ULED: designators C=C1#11 LED=SKLED#11; ports DIN=NetSKLED#10_2 DOUT=NetSKLED#11_2
ULED: designators C=C1#12 LED=SKLED#12; ports DIN=NetSKLED#11_2 DOUT=NetSKLED#12_2
ULED: designators C=C1#13 LED=SKLED#13; ports DIN=NetSKLED#12_2 DOUT=NetSKLED#13_2
ULED: designators C=C1#14 LED=SKLED#14; ports DIN=NetSKLED#13_2 DOUT=NetSKLED#14_2
ULED: designators C=C1#15 LED=SKLED#15; ports DIN=NetSKLED#14_2 DOUT=NetSKLED#15_2
ULED: designators C=C1#16 LED=SKLED#16; ports DIN=NetSKLED#15_2 DOUT=NetSKLED#16_2
ULED: designators C=C1#17 LED=SKLED#17; ports DIN=NetSKLED#16_2 DOUT=NetSKLED#17_2
ULED: designators C=C1#18 LED=SKLED#18; ports DIN=NetSKLED#17_2 DOUT=NetSKLED#18_2
ULED: designators C=C1#19 LED=SKLED#19; ports DIN=NetSKLED#18_2 DOUT=NetSKLED#19_2
ULED: designators C=C1#20 LED=SKLED#20; ports DIN=NetSKLED#19_2 DOUT=NetSKLED#20_2
ULED: designators C=C1#21 LED=SKLED#21; ports DIN=NetSKLED#20_2 DOUT=NetSKLED#21_2
ULED: designators C=C1#22 LED=SKLED#22; ports DIN=NetSKLED#21_2 DOUT=NetSKLED#22_2
ULED: designators C=C1#23 LED=SKLED#23; ports DIN=NetSKLED#22_2 DOUT=NetSKLED#23_2
ULED: designators C=C1#24 LED=SKLED#24; ports DIN=NetSKLED#23_2 DOUT=NetSKLED#24_2
ULED: designators C=C1#25 LED=SKLED#25; ports DIN=NetSKLED#24_2 DOUT=NetSKLED#25_2
ULED: designators C=C1#26 LED=SKLED#26; ports DIN=NetSKLED#25_2 DOUT=NetSKLED#26_2
ULED: designators C=C1#27 LED=SKLED#27; ports DIN=NetSKLED#26_2 DOUT=NetSKLED#27_2
ULED: designators C=C1#28 LED=SKLED#28; ports DIN=NetSKLED#27_2 DOUT=NetSKLED#28_2
ULED: designators C=C1#29 LED=SKLED#29; ports DIN=NetSKLED#28_2 DOUT=NetSKLED#29_2
ULED: designators C=C1#30 LED=SKLED#30; ports DIN=NetSKLED#29_2 DOUT=NetSKLED#30_2
ULED: designators C=C1#31 LED=SKLED#31; ports DIN=NetSKLED#30_2 DOUT=NetSKLED#31_2
ULED: designators C=C1#32 LED=SKLED#32; ports DIN=NetSKLED#31_2 DOUT=NetSKLED#32_2
ULED: designators C=C1#33 LED=SKLED#33; ports DIN=NetSKLED#32_2 DOUT=NetSKLED#33_2
ULED: designators C=C1#34 LED=SKLED#34; ports DIN=NetSKLED#33_2 DOUT=NetSKLED#34_2
ULED: designators C=C1#35 LED=SKLED#35; ports DIN=NetSKLED#34_2 DOUT=NetSKLED#35_2
ULED: designators C=C1#36 LED=SKLED#36; ports DIN=NetSKLED#35_2 DOUT=NetSKLED#36_2
ULED: designators C=C1#37 LED=SKLED#37; ports DIN=NetSKLED#36_2 DOUT=NetSKLED#37_2
ULED: designators C=C1#38 LED=SKLED#38; ports DIN=NetSKLED#37_2 DOUT=NetSKLED#38_2
ULED: designators C=C1#39 LED=SKLED#39; ports DIN=NetSKLED#38_2 DOUT=NetSKLED#39_2
ULED: designators C=C1#40 LED=SKLED#40; ports DIN=NetSKLED#39_2 DOUT=NetSKLED#40_2
ULED: designators C=C1#41 LED=SKLED#41; ports DIN=NetSKLED#40_2 DOUT=NetSKLED#41_2
ULED: designators C=C1#42 LED=SKLED#42; ports DIN=NetSKLED#41_2 DOUT=NetSKLED#42_2
ULED: designators C=C1#43 LED=SKLED#43; ports DIN=NetSKLED#42_2 DOUT=NetSKLED#43_2
ULED: designators C=C1#44 LED=SKLED#44; ports DIN=NetSKLED#43_2 DOUT=NetSKLED#44_2

### Library data of the parts
C = CMP-0001-00074-2: as C2 on sheet Skayboard
LED = SK6812: Individually Adressable SK6812 Mini-E 3528 LED

## Sheet Skey.SchDoc
size 76 x 63 mm
Used 76 times, as channels Esc, 1, 2, 3, 4, 5, 6, 7, 8, 9, 0, -, =, BKSP, Ins, Home, PgUp, Q, W, E, R, T, Y, U, I, O, P, [, ], \, Del, End, PgDn, A, S, D, F, G, H, J, K, L, ;, ", Enter, RCtrl, SK1, SK2, SK3, Z, X, C, V, B, N, M, ,, ., /, RShift, SK4, Up, SK5, LSuper, LAlt, Space, RAlt, RSuper, Meta, Left, Down, Right, Tab, Caps, LShift, LCtrl. Parts and nets are listed once, with the designators drawn on the sheet.
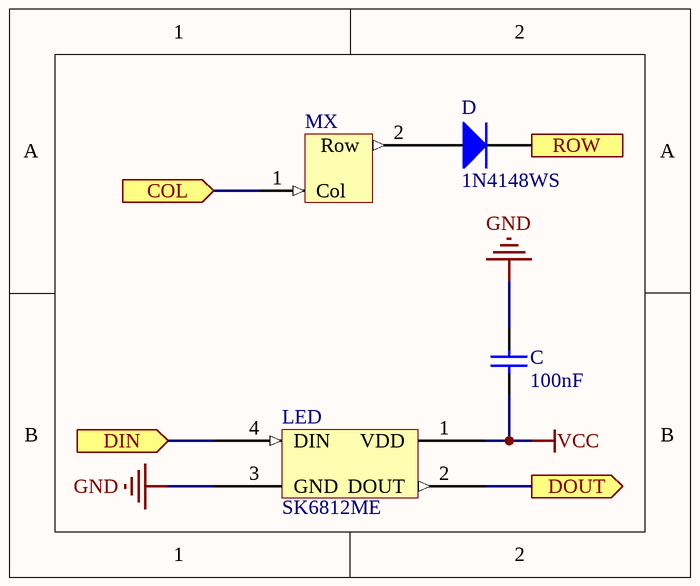
[diagram p3: Skey.SchDoc]

### Parts
C  100nF  [CAPC1005X55X30LL05T10]
D  1N4148WS  [DIOD-SOD323-2-A_V]
LED  SK6812ME  [SK6812ME]
MX  (no value)  [MX]

### Ports
COL (in), DIN (in), DOUT (out), ROW (out)

### Nets
GND: C.2 LED.3(GND)
VCC: C.1 LED.1(VDD)
COL: MX.1(Col) ; port COL
DIN: LED.4(DIN) ; port DIN
DOUT: LED.2(DOUT) ; port DOUT
ROW: D.2(K) ; port ROW
NetD_1: D.1(A) MX.2(Row)

### Channels
Esc: designators end in _Esc; ports COL=NetMX_Caps_1 DIN=NetLED_Esc_4 DOUT=NetLED_1_4 ROW=NetD_0_2
1: designators end in _1; ports COL=NetMX_1_1 DIN=NetLED_1_4 DOUT=NetLED_1_2 ROW=NetD_0_2
2: designators end in _2; ports COL=NetMX_2_1 DIN=NetLED_1_2 DOUT=NetLED_2_2 ROW=NetD_0_2
3: designators end in _3; ports COL=NetMX_3_1 DIN=NetLED_2_2 DOUT=NetLED_3_2 ROW=NetD_0_2
4: designators end in _4; ports COL=NetMX_4_1 DIN=NetLED_3_2 DOUT=NetLED_4_2 ROW=NetD_0_2
5: designators end in _5; ports COL=NetMX_5_1 DIN=NetLED_4_2 DOUT=NetLED_5_2 ROW=NetD_0_2
6: designators end in _6; ports COL=NetMX_6_1 DIN=NetLED_5_2 DOUT=NetLED_6_2 ROW=NetD_0_2
7: designators end in _7; ports COL=NetMX_7_1 DIN=NetLED_6_2 DOUT=NetLED_7_2 ROW=NetD_0_2
8: designators end in _8; ports COL=NetMX_8_1 DIN=NetLED_7_2 DOUT=NetLED_8_2 ROW=NetD_0_2
9: designators end in _9; ports COL=NetMX_9_1 DIN=NetLED_8_2 DOUT=NetLED_0_4 ROW=NetD_0_2
0: designators end in _0; ports COL=NetMX_0_1 DIN=NetLED_0_4 DOUT=NetLED_0_2 ROW=NetD_0_2
-: designators end in _-; ports COL=NetMX_"_1 DIN=NetLED_0_2 DOUT=NetLED_-_2 ROW=NetD_0_2
=: designators end in _=; ports COL=NetMX_=_1 DIN=NetLED_-_2 DOUT=NetLED_=_2 ROW=NetD_0_2
BKSP: designators end in _BKSP; ports COL=NetMX~{_}_1 DIN=NetLED_=_2 DOUT=NetLED_BKSP_2 ROW=NetD_0_2
Ins: designators end in _Ins; ports COL=NetMX_Del_1 DIN=NetLED_BKSP_2 DOUT=NetLED_Home_4 ROW=NetD_0_2
Home: designators end in _Home; ports COL=NetMX_Down_1 DIN=NetLED_Home_4 DOUT=NetLED_Home_2 ROW=NetD_0_2
PgUp: designators end in _PgUp; ports COL=NetMX_PgDn_1 DIN=NetLED_Home_2 DOUT=NetLED_PgUp_2 ROW=NetD_0_2
Q: designators end in _Q; ports COL=NetMX_1_1 DIN=NetLED_Q_4 DOUT=NetLED_Q_2 ROW=NetD_[_2
W: designators end in _W; ports COL=NetMX_2_1 DIN=NetLED_E_2 DOUT=NetLED_Q_4 ROW=NetD_[_2
E: designators end in _E; ports COL=NetMX_3_1 DIN=NetLED_E_4 DOUT=NetLED_E_2 ROW=NetD_[_2
R: designators end in _R; ports COL=NetMX_4_1 DIN=NetLED_R_4 DOUT=NetLED_E_4 ROW=NetD_[_2
T: designators end in _T; ports COL=NetMX_5_1 DIN=NetLED_T_4 DOUT=NetLED_R_4 ROW=NetD_[_2
Y: designators end in _Y; ports COL=NetMX_6_1 DIN=NetLED_U_2 DOUT=NetLED_T_4 ROW=NetD_[_2
U: designators end in _U; ports COL=NetMX_7_1 DIN=NetLED_I_2 DOUT=NetLED_U_2 ROW=NetD_[_2
I: designators end in _I; ports COL=NetMX_8_1 DIN=NetLED_I_4 DOUT=NetLED_I_2 ROW=NetD_[_2
O: designators end in _O; ports COL=NetMX_9_1 DIN=NetLED_O_4 DOUT=NetLED_I_4 ROW=NetD_[_2
P: designators end in _P; ports COL=NetMX_0_1 DIN=NetLED_[_2 DOUT=NetLED_O_4 ROW=NetD_[_2
[: designators end in _[; ports COL=NetMX_"_1 DIN=NetLED_[_4 DOUT=NetLED_[_2 ROW=NetD_[_2
]: designators end in _]; ports COL=NetMX_=_1 DIN=NetLED~{_}_2 DOUT=NetLED_[_4 ROW=NetD_[_2
\: designators end in _\; ports COL=NetMX~{_}_1 DIN=NetLED~{_}_4 DOUT=NetLED~{_}_2 ROW=NetD_[_2
Del: designators end in _Del; ports COL=NetMX_Del_1 DIN=NetLED_Del_4 DOUT=NetLED~{_}_4 ROW=NetD_[_2
End: designators end in _End; ports COL=NetMX_Down_1 DIN=NetLED_End_4 DOUT=NetLED_Del_4 ROW=NetD_[_2
PgDn: designators end in _PgDn; ports COL=NetMX_PgDn_1 DIN=NetLED_PgDn_4 DOUT=NetLED_End_4 ROW=NetD_[_2
A: designators end in _A; ports COL=NetMX_1_1 DIN=NetLED_A_4 DOUT=NetLED_A_2 ROW=NetD_"_2
S: designators end in _S; ports COL=NetMX_2_1 DIN=NetLED_A_2 DOUT=NetLED_D_4 ROW=NetD_"_2
D: designators end in _D; ports COL=NetMX_3_1 DIN=NetLED_D_4 DOUT=NetLED_D_2 ROW=NetD_"_2
F: designators end in _F; ports COL=NetMX_4_1 DIN=NetLED_D_2 DOUT=NetLED_F_2 ROW=NetD_"_2
G: designators end in _G; ports COL=NetMX_5_1 DIN=NetLED_F_2 DOUT=NetLED_G_2 ROW=NetD_"_2
H: designators end in _H; ports COL=NetMX_6_1 DIN=NetLED_G_2 DOUT=NetLED_H_2 ROW=NetD_"_2
J: designators end in _J; ports COL=NetMX_7_1 DIN=NetLED_H_2 DOUT=NetLED_J_2 ROW=NetD_"_2
K: designators end in _K; ports COL=NetMX_8_1 DIN=NetLED_J_2 DOUT=NetLED_K_2 ROW=NetD_"_2
L: designators end in _L; ports COL=NetMX_9_1 DIN=NetLED_K_2 DOUT=NetLED_;_4 ROW=NetD_"_2
;: designators end in _;; ports COL=NetMX_0_1 DIN=NetLED_;_4 DOUT=NetLED_"_4 ROW=NetD_"_2
": designators end in _"; ports COL=NetMX_"_1 DIN=NetLED_"_4 DOUT=NetLED_"_2 ROW=NetD_"_2
Enter: designators end in _Enter; ports COL=NetMX_=_1 DIN=NetLED_"_2 DOUT=NetLED_Enter_2 ROW=NetD_"_2
RCtrl: designators end in _RCtrl; ports COL=NetMX~{_}_1 DIN=NetLED_Meta_2 DOUT=NetLED_Left_4 ROW=NetD_Down_2
SK1: designators end in _SK1; ports COL=NetMX_Del_1 DIN=NetLED_Enter_2 DOUT=NetLED_SK1_2 ROW=NetD_"_2
SK2: designators end in _SK2; ports COL=NetMX_Down_1 DIN=NetLED_SK1_2 DOUT=NetLED_SK2_2 ROW=NetD_"_2
SK3: designators end in _SK3; ports COL=NetMX_PgDn_1 DIN=NetLED_SK2_2 DOUT=NetLED_PgDn_4 ROW=NetD_"_2
Z: designators end in _Z; ports COL=NetMX_1_1 DIN=NetLED_X_2 DOUT=NetLED_LShift_4 ROW=NetD_,_2
X: designators end in _X; ports COL=NetMX_2_1 DIN=NetLED_C_2 DOUT=NetLED_X_2 ROW=NetD_,_2
C: designators end in _C; ports COL=NetMX_3_1 DIN=NetLED_C_4 DOUT=NetLED_C_2 ROW=NetD_,_2
V: designators end in _V; ports COL=NetMX_4_1 DIN=NetLED_B_2 DOUT=NetLED_C_4 ROW=NetD_,_2
B: designators end in _B; ports COL=NetMX_5_1 DIN=NetLED_B_4 DOUT=NetLED_B_2 ROW=NetD_,_2
N: designators end in _N; ports COL=NetMX_6_1 DIN=NetLED_M_2 DOUT=NetLED_B_4 ROW=NetD_,_2
M: designators end in _M; ports COL=NetMX_7_1 DIN=NetLED_,_2 DOUT=NetLED_M_2 ROW=NetD_,_2
,: designators end in _,; ports COL=NetMX_8_1 DIN=NetLED_,_4 DOUT=NetLED_,_2 ROW=NetD_,_2
.: designators end in _.; ports COL=NetMX_9_1 DIN=NetLED_._4 DOUT=NetLED_,_4 ROW=NetD_,_2
/: designators end in _/; ports COL=NetMX_0_1 DIN=NetLED_/_4 DOUT=NetLED_._4 ROW=NetD_,_2
RShift: designators end in _RShift; ports COL=NetMX_"_1 DIN=NetLED_RShift_4 DOUT=NetLED_/_4 ROW=NetD_,_2
SK4: designators end in _SK4; ports COL=NetMX_Del_1 DIN=NetLED_SK4_4 DOUT=NetLED_RShift_4 ROW=NetD_,_2
Up: designators end in _Up; ports COL=NetMX_Down_1 DIN=NetLED_SK5_2 DOUT=NetLED_SK4_4 ROW=NetD_,_2
SK5: designators end in _SK5; ports COL=NetMX_PgDn_1 DIN=NetLED_Right_2 DOUT=NetLED_SK5_2 ROW=NetD_,_2
LSuper: designators end in _LSuper; ports COL=NetMX_1_1 DIN=NetLED_LCtrl_2 DOUT=NetLED_LAlt_4 ROW=NetD_Down_2
LAlt: designators end in _LAlt; ports COL=NetMX_2_1 DIN=NetLED_LAlt_4 DOUT=NetLED_LAlt_2 ROW=NetD_Down_2
Space: designators end in _Space; ports COL=NetMX_5_1 DIN=NetLED_LAlt_2 DOUT=NetLED_RAlt_4 ROW=NetD_Down_2
RAlt: designators end in _RAlt; ports COL=NetMX_9_1 DIN=NetLED_RAlt_4 DOUT=NetLED_RAlt_2 ROW=NetD_Down_2
RSuper: designators end in _RSuper; ports COL=NetMX_0_1 DIN=NetLED_RAlt_2 DOUT=NetLED_Meta_4 ROW=NetD_Down_2
Meta: designators end in _Meta; ports COL=NetMX_"_1 DIN=NetLED_Meta_4 DOUT=NetLED_Meta_2 ROW=NetD_Down_2
Left: designators end in _Left; ports COL=NetMX_Del_1 DIN=NetLED_Left_4 DOUT=NetLED_Down_4 ROW=NetD_Down_2
Down: designators end in _Down; ports COL=NetMX_Down_1 DIN=NetLED_Down_4 DOUT=NetLED_Down_2 ROW=NetD_Down_2
Right: designators end in _Right; ports COL=NetMX_PgDn_1 DIN=NetLED_Down_2 DOUT=NetLED_Right_2 ROW=NetD_Down_2
Tab: designators end in _Tab; ports COL=NetMX_Caps_1 DIN=NetLED_Q_2 DOUT=NetLED_Esc_4 ROW=NetD_[_2
Caps: designators end in _Caps; ports COL=NetMX_Caps_1 DIN=NetLED_Caps_4 DOUT=NetLED_A_4 ROW=NetD_"_2
LShift: designators end in _LShift; ports COL=NetMX_Caps_1 DIN=NetLED_LShift_4 DOUT=NetLED_Caps_4 ROW=NetD_,_2
LCtrl: designators end in _LCtrl; ports COL=NetMX_Caps_1 DIN=NetLED_LCtrl_4 DOUT=NetLED_LCtrl_2 ROW=NetD_Down_2

### Library data of the parts
C = CMP-0001-00074-2: as C2 on sheet Skayboard
D = CMP-1667-00004-1: Fast Switching Diode, 75 V, 0.3 A, -65 to 150 degC, 2-Pin SOD323, RoHS, Tape and Reel
LED = SK6812: as LED on sheet ULED
MX = MX: Cherry MX Footprint

## Nets that join several sheets
GND: Skayboard (21 pins), ULED (C1#1.2 SKLED#1.3), ULED (C1#2.2 SKLED#2.3), ULED (C1#3.2 SKLED#3.3), ULED (C1#4.2 SKLED#4.3), ULED (C1#5.2 SKLED#5.3), ULED (C1#6.2 SKLED#6.3), ULED (C1#7.2 SKLED#7.3), ULED (C1#8.2 SKLED#8.3), ULED (C1#9.2 SKLED#9.3), ULED (C1#10.2 SKLED#10.3), ULED (C1#11.2 SKLED#11.3), ULED (C1#12.2 SKLED#12.3), ULED (C1#13.2 SKLED#13.3), ULED (C1#14.2 SKLED#14.3), ULED (C1#15.2 SKLED#15.3), ULED (C1#16.2 SKLED#16.3), ULED (C1#17.2 SKLED#17.3), ULED (C1#18.2 SKLED#18.3), ULED (C1#19.2 SKLED#19.3), ULED (C1#20.2 SKLED#20.3), ULED (C1#21.2 SKLED#21.3), ULED (C1#22.2 SKLED#22.3), ULED (C1#23.2 SKLED#23.3), ULED (C1#24.2 SKLED#24.3), ULED (C1#25.2 SKLED#25.3), ULED (C1#26.2 SKLED#26.3), ULED (C1#27.2 SKLED#27.3), ULED (C1#28.2 SKLED#28.3), ULED (C1#29.2 SKLED#29.3), ULED (C1#30.2 SKLED#30.3), ULED (C1#31.2 SKLED#31.3), ULED (C1#32.2 SKLED#32.3), ULED (C1#33.2 SKLED#33.3), ULED (C1#34.2 SKLED#34.3), ULED (C1#35.2 SKLED#35.3), ULED (C1#36.2 SKLED#36.3), ULED (C1#37.2 SKLED#37.3), ULED (C1#38.2 SKLED#38.3), ULED (C1#39.2 SKLED#39.3), ULED (C1#40.2 SKLED#40.3), ULED (C1#41.2 SKLED#41.3), ULED (C1#42.2 SKLED#42.3), ULED (C1#43.2 SKLED#43.3), ULED (C1#44.2 SKLED#44.3), Esc (C_Esc.2 LED_Esc.3), 1 (C_1.2 LED_1.3), 2 (C_2.2 LED_2.3), 3 (C_3.2 LED_3.3), 4 (C_4.2 LED_4.3), 5 (C_5.2 LED_5.3), 6 (C_6.2 LED_6.3), 7 (C_7.2 LED_7.3), 8 (C_8.2 LED_8.3), 9 (C_9.2 LED_9.3), 0 (C_0.2 LED_0.3), - (C_-.2 LED_-.3), = (C_=.2 LED_=.3), BKSP (C_BKSP.2 LED_BKSP.3), Ins (C_Ins.2 LED_Ins.3), Home (C_Home.2 LED_Home.3), PgUp (C_PgUp.2 LED_PgUp.3), Q (C_Q.2 LED_Q.3), W (C_W.2 LED_W.3), E (C_E.2 LED_E.3), R (C_R.2 LED_R.3), T (C_T.2 LED_T.3), Y (C_Y.2 LED_Y.3), U (C_U.2 LED_U.3), I (C_I.2 LED_I.3), O (C_O.2 LED_O.3), P (C_P.2 LED_P.3), [ (C_[.2 LED_[.3), ] (C_].2 LED_].3), \ (C_\.2 LED_\.3), Del (C_Del.2 LED_Del.3), End (C_End.2 LED_End.3), PgDn (C_PgDn.2 LED_PgDn.3), A (C_A.2 LED_A.3), S (C_S.2 LED_S.3), D (C_D.2 LED_D.3), F (C_F.2 LED_F.3), G (C_G.2 LED_G.3), H (C_H.2 LED_H.3), J (C_J.2 LED_J.3), K (C_K.2 LED_K.3), L (C_L.2 LED_L.3), ; (C_;.2 LED_;.3), " (C_".2 LED_".3), Enter (C_Enter.2 LED_Enter.3), RCtrl (C_RCtrl.2 LED_RCtrl.3), SK1 (C_SK1.2 LED_SK1.3), SK2 (C_SK2.2 LED_SK2.3), SK3 (C_SK3.2 LED_SK3.3), Z (C_Z.2 LED_Z.3), X (C_X.2 LED_X.3), C (C_C.2 LED_C.3), V (C_V.2 LED_V.3), B (C_B.2 LED_B.3), N (C_N.2 LED_N.3), M (C_M.2 LED_M.3), , (C_,.2 LED_,.3), . (C_..2 LED_..3), / (C_/.2 LED_/.3), RShift (C_RShift.2 LED_RShift.3), SK4 (C_SK4.2 LED_SK4.3), Up (C_Up.2 LED_Up.3), SK5 (C_SK5.2 LED_SK5.3), LSuper (C_LSuper.2 LED_LSuper.3), LAlt (C_LAlt.2 LED_LAlt.3), Space (C_Space.2 LED_Space.3), RAlt (C_RAlt.2 LED_RAlt.3), RSuper (C_RSuper.2 LED_RSuper.3), Meta (C_Meta.2 LED_Meta.3), Left (C_Left.2 LED_Left.3), Down (C_Down.2 LED_Down.3), Right (C_Right.2 LED_Right.3), Tab (C_Tab.2 LED_Tab.3), Caps (C_Caps.2 LED_Caps.3), LShift (C_LShift.2 LED_LShift.3), LCtrl (C_LCtrl.2 LED_LCtrl.3)
VCC: Skayboard (14 pins), ULED (C1#1.1 SKLED#1.1), ULED (C1#2.1 SKLED#2.1), ULED (C1#3.1 SKLED#3.1), ULED (C1#4.1 SKLED#4.1), ULED (C1#5.1 SKLED#5.1), ULED (C1#6.1 SKLED#6.1), ULED (C1#7.1 SKLED#7.1), ULED (C1#8.1 SKLED#8.1), ULED (C1#9.1 SKLED#9.1), ULED (C1#10.1 SKLED#10.1), ULED (C1#11.1 SKLED#11.1), ULED (C1#12.1 SKLED#12.1), ULED (C1#13.1 SKLED#13.1), ULED (C1#14.1 SKLED#14.1), ULED (C1#15.1 SKLED#15.1), ULED (C1#16.1 SKLED#16.1), ULED (C1#17.1 SKLED#17.1), ULED (C1#18.1 SKLED#18.1), ULED (C1#19.1 SKLED#19.1), ULED (C1#20.1 SKLED#20.1), ULED (C1#21.1 SKLED#21.1), ULED (C1#22.1 SKLED#22.1), ULED (C1#23.1 SKLED#23.1), ULED (C1#24.1 SKLED#24.1), ULED (C1#25.1 SKLED#25.1), ULED (C1#26.1 SKLED#26.1), ULED (C1#27.1 SKLED#27.1), ULED (C1#28.1 SKLED#28.1), ULED (C1#29.1 SKLED#29.1), ULED (C1#30.1 SKLED#30.1), ULED (C1#31.1 SKLED#31.1), ULED (C1#32.1 SKLED#32.1), ULED (C1#33.1 SKLED#33.1), ULED (C1#34.1 SKLED#34.1), ULED (C1#35.1 SKLED#35.1), ULED (C1#36.1 SKLED#36.1), ULED (C1#37.1 SKLED#37.1), ULED (C1#38.1 SKLED#38.1), ULED (C1#39.1 SKLED#39.1), ULED (C1#40.1 SKLED#40.1), ULED (C1#41.1 SKLED#41.1), ULED (C1#42.1 SKLED#42.1), ULED (C1#43.1 SKLED#43.1), ULED (C1#44.1 SKLED#44.1), Esc (C_Esc.1 LED_Esc.1), 1 (C_1.1 LED_1.1), 2 (C_2.1 LED_2.1), 3 (C_3.1 LED_3.1), 4 (C_4.1 LED_4.1), 5 (C_5.1 LED_5.1), 6 (C_6.1 LED_6.1), 7 (C_7.1 LED_7.1), 8 (C_8.1 LED_8.1), 9 (C_9.1 LED_9.1), 0 (C_0.1 LED_0.1), - (C_-.1 LED_-.1), = (C_=.1 LED_=.1), BKSP (C_BKSP.1 LED_BKSP.1), Ins (C_Ins.1 LED_Ins.1), Home (C_Home.1 LED_Home.1), PgUp (C_PgUp.1 LED_PgUp.1), Q (C_Q.1 LED_Q.1), W (C_W.1 LED_W.1), E (C_E.1 LED_E.1), R (C_R.1 LED_R.1), T (C_T.1 LED_T.1), Y (C_Y.1 LED_Y.1), U (C_U.1 LED_U.1), I (C_I.1 LED_I.1), O (C_O.1 LED_O.1), P (C_P.1 LED_P.1), [ (C_[.1 LED_[.1), ] (C_].1 LED_].1), \ (C_\.1 LED_\.1), Del (C_Del.1 LED_Del.1), End (C_End.1 LED_End.1), PgDn (C_PgDn.1 LED_PgDn.1), A (C_A.1 LED_A.1), S (C_S.1 LED_S.1), D (C_D.1 LED_D.1), F (C_F.1 LED_F.1), G (C_G.1 LED_G.1), H (C_H.1 LED_H.1), J (C_J.1 LED_J.1), K (C_K.1 LED_K.1), L (C_L.1 LED_L.1), ; (C_;.1 LED_;.1), " (C_".1 LED_".1), Enter (C_Enter.1 LED_Enter.1), RCtrl (C_RCtrl.1 LED_RCtrl.1), SK1 (C_SK1.1 LED_SK1.1), SK2 (C_SK2.1 LED_SK2.1), SK3 (C_SK3.1 LED_SK3.1), Z (C_Z.1 LED_Z.1), X (C_X.1 LED_X.1), C (C_C.1 LED_C.1), V (C_V.1 LED_V.1), B (C_B.1 LED_B.1), N (C_N.1 LED_N.1), M (C_M.1 LED_M.1), , (C_,.1 LED_,.1), . (C_..1 LED_..1), / (C_/.1 LED_/.1), RShift (C_RShift.1 LED_RShift.1), SK4 (C_SK4.1 LED_SK4.1), Up (C_Up.1 LED_Up.1), SK5 (C_SK5.1 LED_SK5.1), LSuper (C_LSuper.1 LED_LSuper.1), LAlt (C_LAlt.1 LED_LAlt.1), Space (C_Space.1 LED_Space.1), RAlt (C_RAlt.1 LED_RAlt.1), RSuper (C_RSuper.1 LED_RSuper.1), Meta (C_Meta.1 LED_Meta.1), Left (C_Left.1 LED_Left.1), Down (C_Down.1 LED_Down.1), Right (C_Right.1 LED_Right.1), Tab (C_Tab.1 LED_Tab.1), Caps (C_Caps.1 LED_Caps.1), LShift (C_LShift.1 LED_LShift.1), LCtrl (C_LCtrl.1 LED_LCtrl.1)
NetD_0_2: Skayboard (U1.29), Esc (D_Esc.2), 1 (D_1.2), 2 (D_2.2), 3 (D_3.2), 4 (D_4.2), 5 (D_5.2), 6 (D_6.2), 7 (D_7.2), 8 (D_8.2), 9 (D_9.2), 0 (D_0.2), - (D_-.2), = (D_=.2), BKSP (D_BKSP.2), Ins (D_Ins.2), Home (D_Home.2), PgUp (D_PgUp.2)
NetD_"_2: Skayboard (U1.31), A (D_A.2), S (D_S.2), D (D_D.2), F (D_F.2), G (D_G.2), H (D_H.2), J (D_J.2), K (D_K.2), L (D_L.2), ; (D_;.2), " (D_".2), Enter (D_Enter.2), SK1 (D_SK1.2), SK2 (D_SK2.2), SK3 (D_SK3.2), Caps (D_Caps.2)
NetD_,_2: Skayboard (U1.32), Z (D_Z.2), X (D_X.2), C (D_C.2), V (D_V.2), B (D_B.2), N (D_N.2), M (D_M.2), , (D_,.2), . (D_..2), / (D_/.2), RShift (D_RShift.2), SK4 (D_SK4.2), Up (D_Up.2), SK5 (D_SK5.2), LShift (D_LShift.2)
NetD_[_2: Skayboard (U1.30), Q (D_Q.2), W (D_W.2), E (D_E.2), R (D_R.2), T (D_T.2), Y (D_Y.2), U (D_U.2), I (D_I.2), O (D_O.2), P (D_P.2), [ (D_[.2), ] (D_].2), \ (D_\.2), Del (D_Del.2), End (D_End.2), PgDn (D_PgDn.2), Tab (D_Tab.2)
NetD_Down_2: Skayboard (U1.33), RCtrl (D_RCtrl.2), LSuper (D_LSuper.2), LAlt (D_LAlt.2), Space (D_Space.2), RAlt (D_RAlt.2), RSuper (D_RSuper.2), Meta (D_Meta.2), Left (D_Left.2), Down (D_Down.2), Right (D_Right.2), LCtrl (D_LCtrl.2)
NetLED_0_2: 0 (LED_0.2), - (LED_-.4)
NetLED_0_4: 9 (LED_9.2), 0 (LED_0.4)
NetLED_1_2: 1 (LED_1.2), 2 (LED_2.4)
NetLED_1_4: Esc (LED_Esc.2), 1 (LED_1.4)
NetLED_2_2: 2 (LED_2.2), 3 (LED_3.4)
NetLED_3_2: 3 (LED_3.2), 4 (LED_4.4)
NetLED_4_2: 4 (LED_4.2), 5 (LED_5.4)
NetLED_5_2: 5 (LED_5.2), 6 (LED_6.4)
NetLED_6_2: 6 (LED_6.2), 7 (LED_7.4)
NetLED_7_2: 7 (LED_7.2), 8 (LED_8.4)
NetLED_8_2: 8 (LED_8.2), 9 (LED_9.4)
NetLED_"_2: " (LED_".2), Enter (LED_Enter.4)
NetLED_"_4: ; (LED_;.2), " (LED_".4)
NetLED_,_2: M (LED_M.4), , (LED_,.2)
NetLED_,_4: , (LED_,.4), . (LED_..2)
NetLED_-_2: - (LED_-.2), = (LED_=.4)
NetLED_._4: . (LED_..4), / (LED_/.2)
NetLED_/_4: / (LED_/.4), RShift (LED_RShift.2)
NetLED_;_4: L (LED_L.2), ; (LED_;.4)
NetLED_=_2: = (LED_=.2), BKSP (LED_BKSP.4)
NetLED_[_2: P (LED_P.4), [ (LED_[.2)
NetLED_[_4: [ (LED_[.4), ] (LED_].2)
NetLED~{_}_2: ] (LED_].4), \ (LED_\.2)
NetLED~{_}_4: \ (LED_\.4), Del (LED_Del.2)
NetLED_A_2: A (LED_A.2), S (LED_S.4)
NetLED_A_4: A (LED_A.4), Caps (LED_Caps.2)
NetLED_B_2: V (LED_V.4), B (LED_B.2)
NetLED_B_4: B (LED_B.4), N (LED_N.2)
NetLED_BKSP_2: BKSP (LED_BKSP.2), Ins (LED_Ins.4)
NetLED_C_2: X (LED_X.4), C (LED_C.2)
NetLED_C_4: C (LED_C.4), V (LED_V.2)
NetLED_Caps_4: Caps (LED_Caps.4), LShift (LED_LShift.2)
NetLED_D_2: D (LED_D.2), F (LED_F.4)
NetLED_D_4: S (LED_S.2), D (LED_D.4)
NetLED_Del_4: Del (LED_Del.4), End (LED_End.2)
NetLED_Down_2: Down (LED_Down.2), Right (LED_Right.4)
NetLED_Down_4: Left (LED_Left.2), Down (LED_Down.4)
NetLED_E_2: W (LED_W.4), E (LED_E.2)
NetLED_E_4: E (LED_E.4), R (LED_R.2)
NetLED_End_4: End (LED_End.4), PgDn (LED_PgDn.2)
NetLED_Enter_2: Enter (LED_Enter.2), SK1 (LED_SK1.4)
NetLED_Esc_4: Esc (LED_Esc.4), Tab (LED_Tab.2)
NetLED_F_2: F (LED_F.2), G (LED_G.4)
NetLED_G_2: G (LED_G.2), H (LED_H.4)
NetLED_H_2: H (LED_H.2), J (LED_J.4)
NetLED_Home_2: Home (LED_Home.2), PgUp (LED_PgUp.4)
NetLED_Home_4: Ins (LED_Ins.2), Home (LED_Home.4)
NetLED_I_2: U (LED_U.4), I (LED_I.2)
NetLED_I_4: I (LED_I.4), O (LED_O.2)
NetLED_J_2: J (LED_J.2), K (LED_K.4)
NetLED_K_2: K (LED_K.2), L (LED_L.4)
NetLED_LAlt_2: LAlt (LED_LAlt.2), Space (LED_Space.4)
NetLED_LAlt_4: LSuper (LED_LSuper.2), LAlt (LED_LAlt.4)
NetLED_LCtrl_2: LSuper (LED_LSuper.4), LCtrl (LED_LCtrl.2)
NetLED_LCtrl_4: Skayboard (U1.26), LCtrl (LED_LCtrl.4)
NetLED_Left_4: RCtrl (LED_RCtrl.2), Left (LED_Left.4)
NetLED_LShift_4: Z (LED_Z.2), LShift (LED_LShift.4)
NetLED_M_2: N (LED_N.4), M (LED_M.2)
NetLED_Meta_2: RCtrl (LED_RCtrl.4), Meta (LED_Meta.2)
NetLED_Meta_4: RSuper (LED_RSuper.2), Meta (LED_Meta.4)
NetLED_O_4: O (LED_O.4), P (LED_P.2)
NetLED_PgDn_4: PgDn (LED_PgDn.4), SK3 (LED_SK3.2)
NetLED_PgUp_2: ULED (SKLED#1.4), PgUp (LED_PgUp.2)
NetLED_Q_2: Q (LED_Q.2), Tab (LED_Tab.4)
NetLED_Q_4: Q (LED_Q.4), W (LED_W.2)
NetLED_R_4: R (LED_R.4), T (LED_T.2)
NetLED_RAlt_2: RAlt (LED_RAlt.2), RSuper (LED_RSuper.4)
NetLED_RAlt_4: Space (LED_Space.2), RAlt (LED_RAlt.4)
NetLED_Right_2: SK5 (LED_SK5.4), Right (LED_Right.2)
NetLED_RShift_4: RShift (LED_RShift.4), SK4 (LED_SK4.2)
NetLED_SK1_2: SK1 (LED_SK1.2), SK2 (LED_SK2.4)
NetLED_SK2_2: SK2 (LED_SK2.2), SK3 (LED_SK3.4)
NetLED_SK4_4: SK4 (LED_SK4.4), Up (LED_Up.2)
NetLED_SK5_2: Up (LED_Up.4), SK5 (LED_SK5.2)
NetLED_T_4: T (LED_T.4), Y (LED_Y.2)
NetLED_U_2: Y (LED_Y.4), U (LED_U.2)
NetLED_X_2: Z (LED_Z.4), X (LED_X.2)
NetMX_0_1: Skayboard (U1.41), 0 (MX_0.1), P (MX_P.1), ; (MX_;.1), / (MX_/.1), RSuper (MX_RSuper.1)
NetMX_1_1: Skayboard (U1.19), 1 (MX_1.1), Q (MX_Q.1), A (MX_A.1), Z (MX_Z.1), LSuper (MX_LSuper.1)
NetMX_2_1: Skayboard (U1.20), 2 (MX_2.1), W (MX_W.1), S (MX_S.1), X (MX_X.1), LAlt (MX_LAlt.1)
NetMX_3_1: Skayboard (U1.21), 3 (MX_3.1), E (MX_E.1), D (MX_D.1), C (MX_C.1)
NetMX_4_1: Skayboard (U1.22), 4 (MX_4.1), R (MX_R.1), F (MX_F.1), V (MX_V.1)
NetMX_5_1: Skayboard (U1.25), 5 (MX_5.1), T (MX_T.1), G (MX_G.1), B (MX_B.1), Space (MX_Space.1)
NetMX_6_1: Skayboard (U1.37), 6 (MX_6.1), Y (MX_Y.1), H (MX_H.1), N (MX_N.1)
NetMX_7_1: Skayboard (U1.38), 7 (MX_7.1), U (MX_U.1), J (MX_J.1), M (MX_M.1)
NetMX_8_1: Skayboard (U1.39), 8 (MX_8.1), I (MX_I.1), K (MX_K.1), , (MX_,.1)
NetMX_9_1: Skayboard (U1.40), 9 (MX_9.1), O (MX_O.1), L (MX_L.1), . (MX_..1), RAlt (MX_RAlt.1)
NetMX_"_1: Skayboard (U1.1), - (MX_-.1), [ (MX_[.1), " (MX_".1), RShift (MX_RShift.1), Meta (MX_Meta.1)
NetMX_=_1: Skayboard (U1.8), = (MX_=.1), ] (MX_].1), Enter (MX_Enter.1)
NetMX~{_}_1: Skayboard (U1.9), BKSP (MX_BKSP.1), \ (MX_\.1), RCtrl (MX_RCtrl.1)
NetMX_Caps_1: Skayboard (U1.18), Esc (MX_Esc.1), Tab (MX_Tab.1), Caps (MX_Caps.1), LShift (MX_LShift.1), LCtrl (MX_LCtrl.1)
NetMX_Del_1: Skayboard (U1.10), Ins (MX_Ins.1), Del (MX_Del.1), SK1 (MX_SK1.1), SK4 (MX_SK4.1), Left (MX_Left.1)
NetMX_Down_1: Skayboard (U1.11), Home (MX_Home.1), End (MX_End.1), SK2 (MX_SK2.1), Up (MX_Up.1), Down (MX_Down.1)
NetMX_PgDn_1: Skayboard (U1.12), PgUp (MX_PgUp.1), PgDn (MX_PgDn.1), SK3 (MX_SK3.1), SK5 (MX_SK5.1), Right (MX_Right.1)
NetSKLED#1_2: ULED (SKLED#1.2), ULED (SKLED#2.4)
NetSKLED#2_2: ULED (SKLED#2.2), ULED (SKLED#3.4)
NetSKLED#3_2: ULED (SKLED#3.2), ULED (SKLED#4.4)
NetSKLED#4_2: ULED (SKLED#4.2), ULED (SKLED#5.4)
NetSKLED#5_2: ULED (SKLED#5.2), ULED (SKLED#6.4)
NetSKLED#6_2: ULED (SKLED#6.2), ULED (SKLED#7.4)
NetSKLED#7_2: ULED (SKLED#7.2), ULED (SKLED#8.4)
NetSKLED#8_2: ULED (SKLED#8.2), ULED (SKLED#9.4)
NetSKLED#9_2: ULED (SKLED#9.2), ULED (SKLED#10.4)
NetSKLED#10_2: ULED (SKLED#10.2), ULED (SKLED#11.4)
NetSKLED#11_2: ULED (SKLED#11.2), ULED (SKLED#12.4)
NetSKLED#12_2: ULED (SKLED#12.2), ULED (SKLED#13.4)
NetSKLED#13_2: ULED (SKLED#13.2), ULED (SKLED#14.4)
NetSKLED#14_2: ULED (SKLED#14.2), ULED (SKLED#15.4)
NetSKLED#15_2: ULED (SKLED#15.2), ULED (SKLED#16.4)
NetSKLED#16_2: ULED (SKLED#16.2), ULED (SKLED#17.4)
NetSKLED#17_2: ULED (SKLED#17.2), ULED (SKLED#18.4)
NetSKLED#18_2: ULED (SKLED#18.2), ULED (SKLED#19.4)
NetSKLED#19_2: ULED (SKLED#19.2), ULED (SKLED#20.4)
NetSKLED#20_2: ULED (SKLED#20.2), ULED (SKLED#21.4)
NetSKLED#21_2: ULED (SKLED#21.2), ULED (SKLED#22.4)
NetSKLED#22_2: ULED (SKLED#22.2), ULED (SKLED#23.4)
NetSKLED#23_2: ULED (SKLED#23.2), ULED (SKLED#24.4)
NetSKLED#24_2: ULED (SKLED#24.2), ULED (SKLED#25.4)
NetSKLED#25_2: ULED (SKLED#25.2), ULED (SKLED#26.4)
NetSKLED#26_2: ULED (SKLED#26.2), ULED (SKLED#27.4)
NetSKLED#27_2: ULED (SKLED#27.2), ULED (SKLED#28.4)
NetSKLED#28_2: ULED (SKLED#28.2), ULED (SKLED#29.4)
NetSKLED#29_2: ULED (SKLED#29.2), ULED (SKLED#30.4)
NetSKLED#30_2: ULED (SKLED#30.2), ULED (SKLED#31.4)
NetSKLED#31_2: ULED (SKLED#31.2), ULED (SKLED#32.4)
NetSKLED#32_2: ULED (SKLED#32.2), ULED (SKLED#33.4)
NetSKLED#33_2: ULED (SKLED#33.2), ULED (SKLED#34.4)
NetSKLED#34_2: ULED (SKLED#34.2), ULED (SKLED#35.4)
NetSKLED#35_2: ULED (SKLED#35.2), ULED (SKLED#36.4)
NetSKLED#36_2: ULED (SKLED#36.2), ULED (SKLED#37.4)
NetSKLED#37_2: ULED (SKLED#37.2), ULED (SKLED#38.4)
NetSKLED#38_2: ULED (SKLED#38.2), ULED (SKLED#39.4)
NetSKLED#39_2: ULED (SKLED#39.2), ULED (SKLED#40.4)
NetSKLED#40_2: ULED (SKLED#40.2), ULED (SKLED#41.4)
NetSKLED#41_2: ULED (SKLED#41.2), ULED (SKLED#42.4)
NetSKLED#42_2: ULED (SKLED#42.2), ULED (SKLED#43.4)
NetSKLED#43_2: ULED (SKLED#43.2), ULED (SKLED#44.4)